# Altium project BAI2.PrjPcb
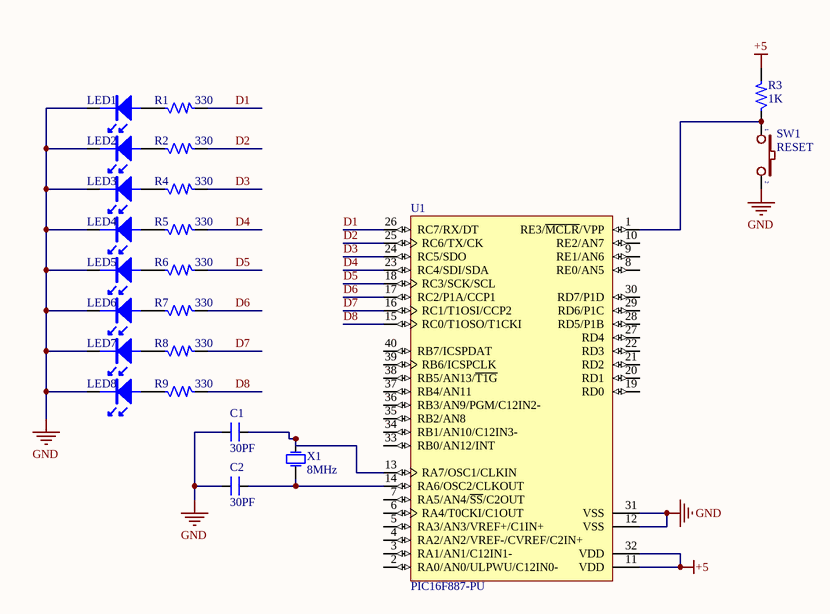
[diagram p0: BAI2.SchDoc]
1 sheet, 22 parts. Net scope: global (net labels, ports and power ports of the same name join across sheets).

## Sheet BAI2.SchDoc
size A; SheetNumber: 1; SheetTotal: 1

### Parts
C1  30PF  [SM-0805]
C2  30PF  [SM-0805]
LED1  LED  [CAP10UF]  (value not drawn)
LED2  LED  [CAP10UF]  (value not drawn)
LED3  LED  [CAP10UF]  (value not drawn)
LED4  LED  [CAP10UF]  (value not drawn)
LED5  LED  [CAP10UF]  (value not drawn)
LED6  LED  [CAP10UF]  (value not drawn)
LED7  LED  [CAP10UF]  (value not drawn)
LED8  LED  [CAP10UF]  (value not drawn)
R1  330  [R1/6W]
R2  330  [R1/6W]
R3  1K  [R1/6W]
R4  330  [R1/6W]
R5  330  [R1/6W]
R6  330  [R1/6W]
R7  330  [R1/6W]
R8  330  [R1/6W]
R9  330  [R1/6W]
SW1  RESET  [SW2]
U1  PIC16F887-PU  [DIP40/W0.6]
X1  8MHz  [XT2]

### Nets
+5: R3.2 U1.11(VDD) U1.32(VDD)
GND: C1.1 C2.1 LED1.2 LED2.2 LED3.2 LED4.2 LED5.2 LED6.2 LED7.2 LED8.2 SW1.2 U1.12(VSS) U1.31(VSS)
D1: R1.2 U1.26(RC7/RX/DT)
D2: R2.2 U1.25(RC6/TX/CK)
D3: R4.2 U1.24(RC5/SDO)
D4: R5.2 U1.23(RC4/SDI/SDA)
D5: R6.2 U1.18(RC3/SCK/SCL)
D6: R7.2 U1.17(RC2/P1A/CCP1)
D7: R8.2 U1.16(RC1/T1OSI/CCP2)
D8: R9.2 U1.15(RC0/T1OSO/T1CKI)
NetC1_2: C1.2 U1.13(RA7/OSC1/CLKIN) X1.2(OSC2)
NetC2_2: C2.2 U1.14(RA6/OSC2/CLKOUT) X1.1(OSC1)
NetLED1_1: LED1.1 R1.1
NetLED2_1: LED2.1 R2.1
NetLED3_1: LED3.1 R4.1
NetLED4_1: LED4.1 R5.1
NetLED5_1: LED5.1 R6.1
NetLED6_1: LED6.1 R7.1
NetLED7_1: LED7.1 R8.1
NetLED8_1: LED8.1 R9.1
NetR3_1: R3.1 SW1.1 U1.1(RE3/~{MCLR}/VPP)

Not connected (* = marked no-connect by the designer): U1 2(RA0/AN0/ULPWU/C12IN0-) 3(RA1/AN1/C12IN1-) 4(RA2/AN2/VREF-/CVREF/C2IN+) 5(RA3/AN3/VREF+/C1IN+) 6(RA4/T0CKI/C1OUT) 7(RA5/AN4/~{SS}/C2OUT) 8(RE0/AN5) 9(RE1/AN6) 10(RE2/AN7) 19(RD0) 20(RD1) 21(RD2) 22(RD3) 27(RD4) 28(RD5/P1B) 29(RD6/P1C) 30(RD7/P1D) 33(RB0/AN12/INT) 34(RB1/AN10/C12IN3-) 35(RB2/AN8) 36(RB3/AN9/PGM/C12IN2-) 37(RB4/AN11) 38(RB5/AN13/~{T1G}) 39(RB6/ICSPCLK) 40(RB7/ICSPDAT)

### Library data of the parts
C1 C2 = CM: Cap SMD; Value: 103
R1-R9 = Res: Resistor 1/4W; Value: R1/4W - 1K
SW1 = SW2: Switch button 2 pin; Value: SW chip 2 pin
U1 = PIC16F887-PU: Flash-Based, 8-Bit CMOS Microcontroller with nanoWatt Technology, 8K (x14-Bit words) Program Memory, 624 Bytes Data Memory, 35 I/O pins, 40-Pin PDIP, Standard VDD Range, Extended Temperature; Published: 29-Jan-2009; LatestRevisionDate: 02-Dec-2009; LatestRevisionNote: Updated datasheet to version revF, Apr-2009.; DatasheetVersion: revF, Apr-2009; PackageVersion: revBB, Aug-2009; PackageReference: PDIP600-P40; Publisher: Altium Limited; PackageDescription: 40-Lead Plastic Dual In-Line (P) - 600 mil Body [PDIP]; Supplier 1: Digi-Key; Supplier Part Number 1: PIC16F887-E/P-ND; Supplier 2: Farnell; Supplier Part Number 2: 1703423; ComponentLink1Description: Datasheet; ComponentLink1URL: http://ww1.microchip.com/downloads/en/DeviceDoc/41291F.pdf; ComponentLink2Description: Packaging Specification; ComponentLink2URL: http://www.microchip.com/stellent/groups/techpub_sg/documents/packagingspec/en012702.pdf; ComponentLink3Description: Microchip.com Home; ComponentLink3URL: http://www.microchip.com/
X1 = Crystal: Crystal Oscillator; Published: 8-Jun-2000; LatestRevisionDate: 17-Jul-2002; LatestRevisionNote: Re-released for DXP Platform.; PackageReference: R38; Publisher: Altium Limited